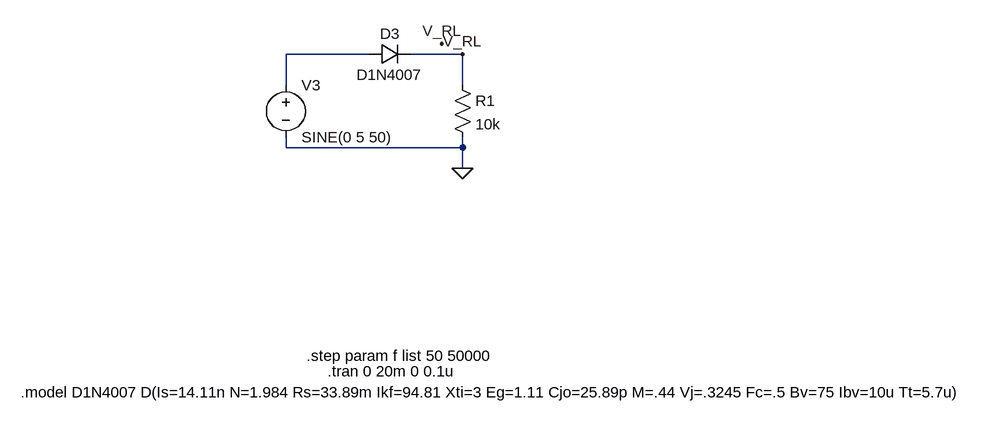
[diagram p0: schematic diodo2.asc]
diodo2.asc, the LTspice schematic file:
Version 4
SHEET 1 1572 680
WIRE 432 -144 304 -144
WIRE 576 -144 496 -144
WIRE 304 -96 304 -144
WIRE 576 -96 576 -144
WIRE 304 0 304 -16
WIRE 576 0 576 -16
WIRE 576 0 304 0
WIRE 576 32 576 0
FLAG 576 32 0
FLAG 576 -144 V_RL
FLAG 544 -160 V_RL
SYMBOL voltage 304 -112 R0
WINDOW 123 0 0 Left 2
WINDOW 39 0 0 Left 2
SYMATTR InstName V3
SYMATTR Value SINE(0 5 50)
SYMBOL diode 432 -128 R270
WINDOW 0 32 32 VTop 2
WINDOW 3 0 32 VBottom 2
SYMATTR InstName D3
SYMATTR Value D1N4007
SYMBOL res 560 -112 R0
SYMATTR InstName R1
SYMATTR Value 10k
TEXT 336 320 Left 2 !.step param f list 50 50000
TEXT 368 344 Left 2 !.tran 0 20m 0 0.1u
TEXT -104 376 Left 2 !.model D1N4007 D(Is=14.11n N=1.984 Rs=33.89m Ikf=94.81 Xti=3 Eg=1.11 Cjo=25.89p M=.44 Vj=.3245 Fc=.5 Bv=75 Ibv=10u Tt=5.7u)

The netlist it stands for:
* diodo2.asc
V3 N001 0 SINE(0 5 50)
D3 N001 V_RL D1N4007
R1 V_RL 0 10k
.model D D
.lib standard.dio
.step param f list 50 50000
.tran 0 20m 0 0.1u
.model D1N4007 D(Is=14.11n N=1.984 Rs=33.89m Ikf=94.81 Xti=3 Eg=1.11 Cjo=25.89p M=.44 Vj=.3245 Fc=.5 Bv=75 Ibv=10u Tt=5.7u)
.backanno
.end